# EAGLE design front-panel-module (EAGLE 5.11)
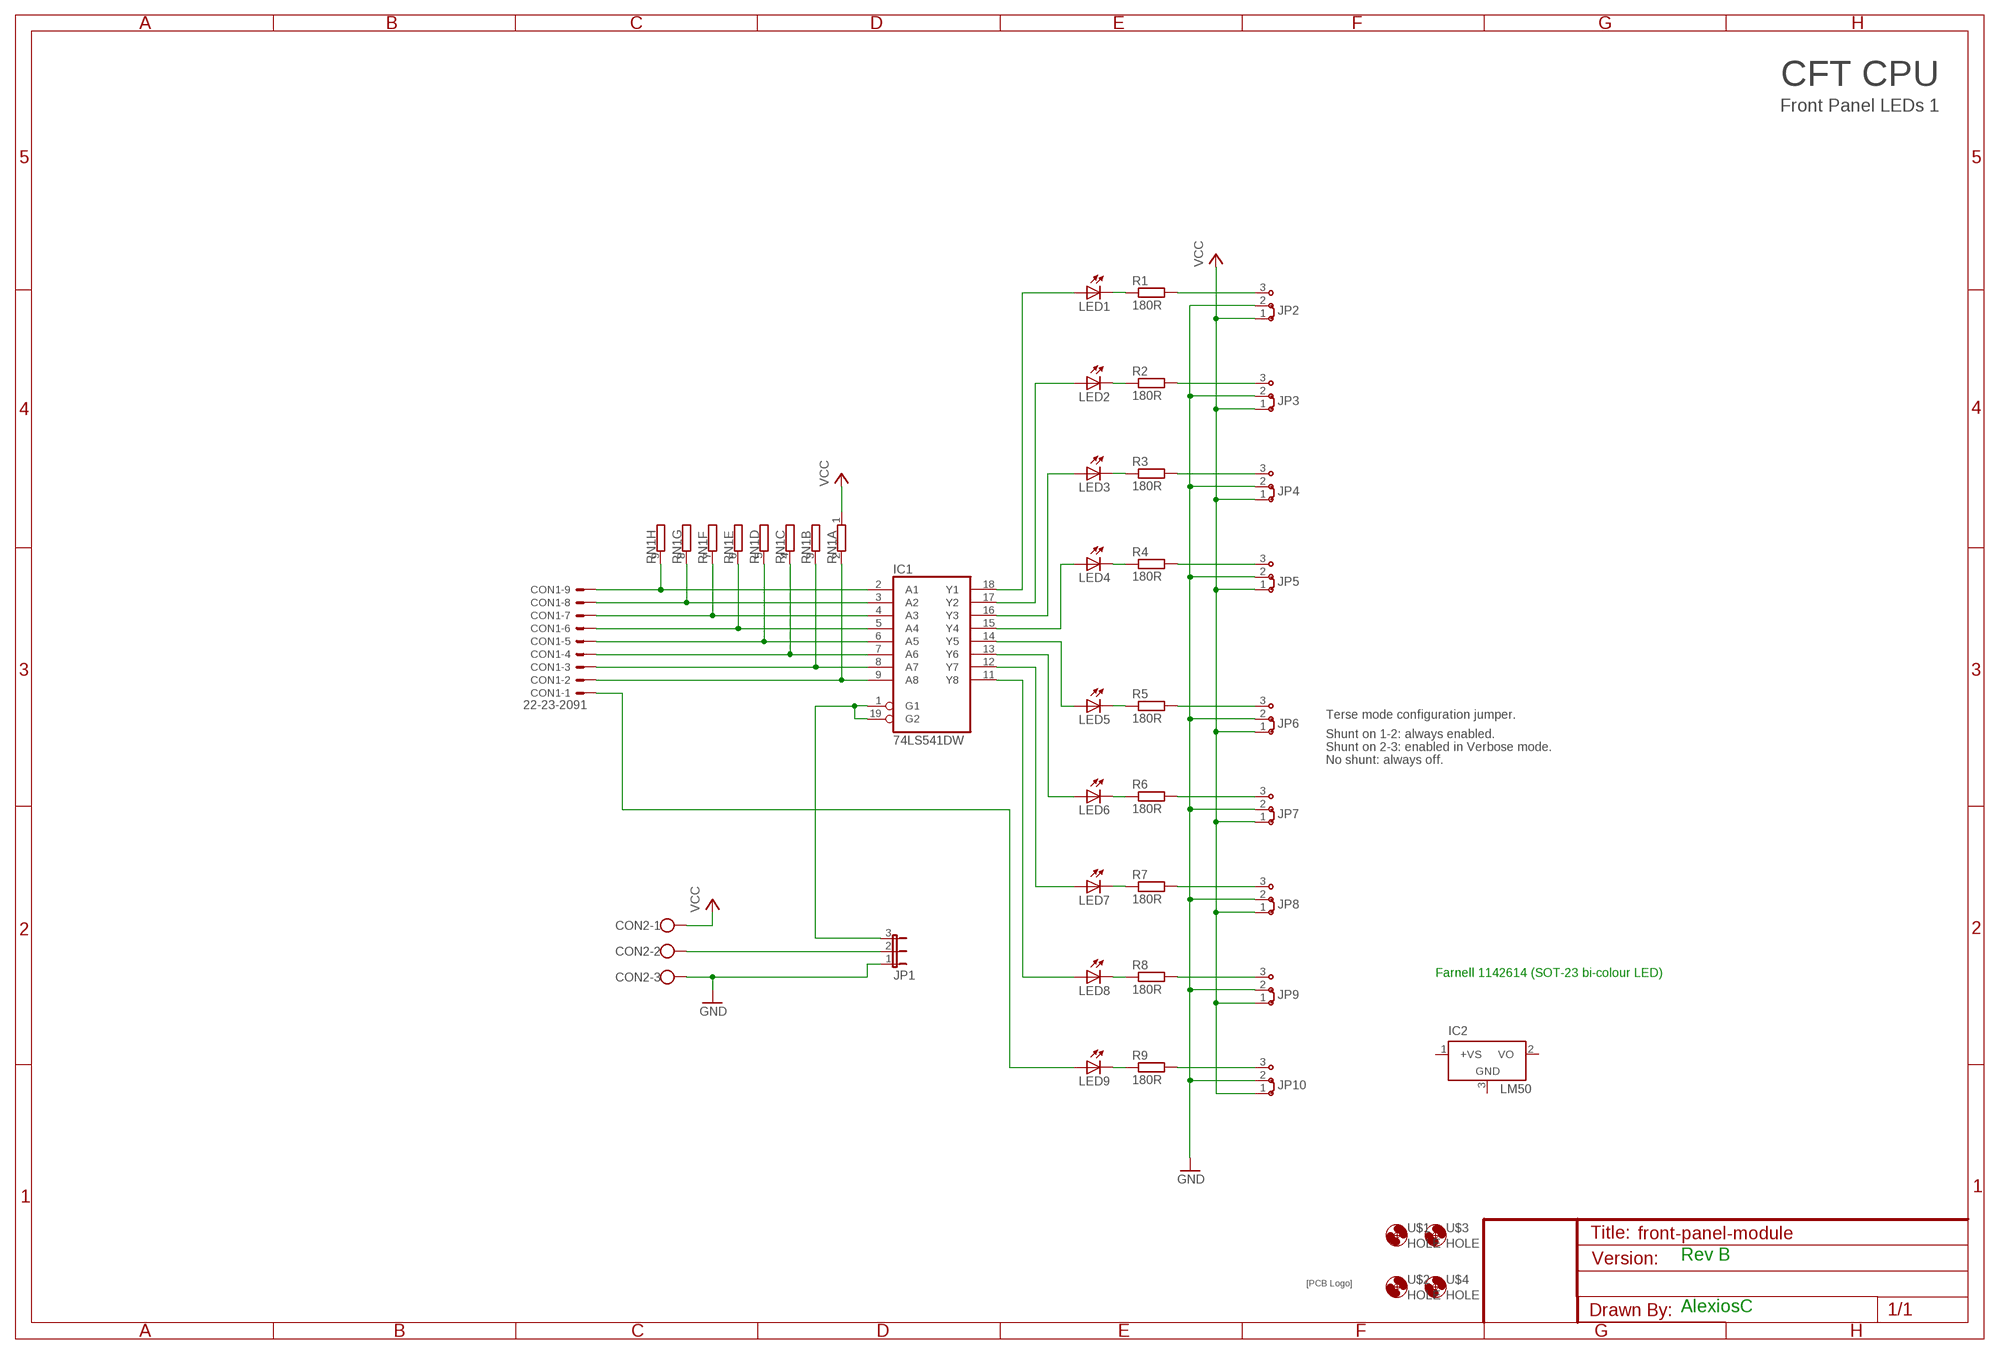
[diagram p0: schematic, sheet 1]

## Parts
CON1  22-23-2091  [22-23-2091]
CON2  W237-103  [W237-103]
IC1  74LS541DW  [SO20W]
IC2  LM50  [SOT23]
JP1  JP2E  [JP2]
JP2  J2  [WJ-100]
JP3  J2  [WJ-100]
JP4  J2  [WJ-100]
JP5  J2  [WJ-100]
JP6  J2  [WJ-100]
JP7  J2  [WJ-100]
JP8  J2  [WJ-100]
JP9  J2  [WJ-100]
JP10  J2  [WJ-100]
LED1  LED-5MM-AMBER  LEDP-LCC-2  [P-LCC-2]
LED2  LED-5MM-AMBER  LEDP-LCC-2  [P-LCC-2]
LED3  LED-5MM-AMBER  LEDP-LCC-2  [P-LCC-2]
LED4  LED-5MM-AMBER  LEDP-LCC-2  [P-LCC-2]
LED5  LED-5MM-AMBER  LEDP-LCC-2  [P-LCC-2]
LED6  LED-5MM-AMBER  LEDP-LCC-2  [P-LCC-2]
LED7  LED-5MM-AMBER  LEDP-LCC-2  [P-LCC-2]
LED8  LED-5MM-AMBER  LEDP-LCC-2  [P-LCC-2]
LED9  LED-5MM-AMBER  LEDP-LCC-2  [P-LCC-2]
R1  180R  R-EU_M0805  [M0805]
R2  180R  R-EU_M0805  [M0805]
R3  180R  R-EU_M0805  [M0805]
R4  180R  R-EU_M0805  [M0805]
R5  180R  R-EU_M0805  [M0805]
R6  180R  R-EU_M0805  [M0805]
R7  180R  R-EU_M0805  [M0805]
R8  180R  R-EU_M0805  [M0805]
R9  180R  R-EU_M0805  [M0805]
RN1  GE08R  [SIL9]
U$1  HOLE  [STANDOFF_28_60]
U$2  HOLE  [STANDOFF_28_60]
U$3  HOLE  [STANDOFF_28_60]
U$4  HOLE  [STANDOFF_28_60]
U$6  SIGNATURESILK  [SIGNATURE]

## Nets
BANK0: CON1.9 IC1.2(A1) RN1.9
BANK1: CON1.8 IC1.3(A2) RN1.8
BANK2: CON1.7 IC1.4(A3) RN1.7
BANK3: CON1.6 IC1.5(A4) RN1.6
BANK4: CON1.5 IC1.6(A5) RN1.5
BANK5: CON1.4 IC1.7(A6) RN1.4
BANK6: CON1.3 IC1.8(A7) RN1.3
BANK7: CON1.2 IC1.9(A8) RN1.2
BANKING: CON1.1 LED9.A
GND: CON2.3 JP1.1 JP2.2 JP3.2 JP4.2 JP5.2 JP6.2 JP7.2 JP8.2 JP9.2 JP10.2
N$1: CON2.2 JP1.2
N$2: IC1.1(G1) IC1.19(G2) JP1.3
N$3: LED1.C R1.1
N$4: JP2.3 R1.2
N$5: JP3.3 R2.2
N$6: JP4.3 R3.2
N$7: JP5.3 R4.2
N$8: JP6.3 R5.2
N$9: JP7.3 R6.2
N$10: JP8.3 R7.2
N$11: JP9.3 R8.2
N$12: LED9.C R9.1
N$13: JP10.3 R9.2
N$84: IC1.15(Y4) LED4.A
N$101: IC1.14(Y5) LED5.A
N$103: IC1.13(Y6) LED6.A
N$104: IC1.12(Y7) LED7.A
N$105: IC1.11(Y8) LED8.A
N$106: IC1.16(Y3) LED3.A
N$107: IC1.17(Y2) LED2.A
N$108: IC1.18(Y1) LED1.A
N$110: LED2.C R2.1
N$111: LED3.C R3.1
N$114: LED4.C R4.1
N$115: LED5.C R5.1
N$116: LED6.C R6.1
N$117: LED7.C R7.1
N$118: LED8.C R8.1
VCC: CON2.1 JP2.1 JP3.1 JP4.1 JP5.1 JP6.1 JP7.1 JP8.1 JP9.1 JP10.1 RN1.1
Unconnected: IC2.1(+VS) IC2.2(VO)

## Notes on the sheet
- CFT CPU
- Front Panel LEDs 1
- Terse mode configuration jumper.
- Shunt on 1-2: always enabled.
- Shunt on 2-3: enabled in Verbose mode.
- No shunt: always off.
- Farnell 1142614 (SOT-23 bi-colour LED)
- Rev B
- AlexiosC

## Power pins joined to a net without a drawn wire
GND: IC1.10(GND) IC2.3(GND)
VCC: IC1.20(VCC)

## Library data of the parts
CON1 = con-molex:22-23-2091: .100" (2.54mm) Center Header - 9 Pin; MF: MOLEX; MPN: 22-23-2091; OC_FARNELL: 1756827; OC_NEWARK: 56H0450
CON2 = con-wago-500:W237-103: WAGO SCREW CLAMP; MPN: 237-103; OC_FARNELL: unknown; OC_NEWARK: 18M7116
IC1 = 74xx-eu:74*541: Octal BUFFER and LINE DRIVER, 3-state
IC2 = linear:LM50: SOT-23 Single-Supply Centigrade Temperature Sensor Vout = (10mV/°C x Temp °C) +5mmmV Source: http://cache.national.com/ds/LM/LM50.pdf
JP1 = jumper:JP2E: JUMPER
JP2-JP10 = alexios:J2: Wire jumper
LED1-LED9 = led:LED: LED OSRAM: - CHIPLED LG R971, LG N971, LY N971, LG Q971, LY Q971, LO R971, LY R971 LH N974, LH R974 LS Q976, LO Q976, LY Q976 LO Q996 - Hyper CHIPLED LW Q18S LB Q993, LB Q99A, LB R99A - SideLED LS A670, LO A670, LY A670, LG A670, LP A670 LB A673, LV A673, LT A673, LW A673 LH A674 LY A675 LS A676, LA A676, LO A676, LY A676, LW A676 LS A679, LY A679, LG A679 - Hyper Micro SIDELED® LS Y876, LA Y876, LO Y876, LY Y876 LT Y87S - SmartLED LW L88C, LW L88S LB L89C, LB L89S, LG L890 LS L89K, LO L89K, LY L89K LS L896, LA L896, LO L896, LY L896 - TOPLED LS T670, LO T670, LY T670, LG T670, LP T670 LSG T670, LSP T670, LSY T670, LOP T670, LYG T670 LG T671, LOG T671, LSG T671 LB T673, LV T673, LT T673, LW T673 LH T674 LS T676, LA T676, LO T676, LY T676, LB T676, LH T676, LSB T676, LW T676 LB T67C, LV T67C, LT T67C, LS T67K, LO T67K, LY T67K, LW E67C LS E67B, LA E67B, LO E67B, LY E67B, LB E67C, LV E67C, LT E67C LW T67C LS T679, LY T679, LG T679 LS T770, LO T770, LY T770, LG T770, LP T770 LB T773, LV T773, LT T773, LW T773 LH T774 LS E675, LA E675, LY E675, LS T675 LS T776, LA T776, LO T776, LY T776, LB T776 LHGB T686 LT T68C, LB T68C - Hyper Mini TOPLED® LB M676 - Mini TOPLED Santana® LG M470 LS M47K, LO M47K, LY M47K Source: http://www.osram.convergy.de LUXEON: - LUMILED® LXK2-PW12-R00, LXK2-PW12-S00, LXK2-PW14-U00, LXK2-PW14-V00 LXK2-PM12-R00, LXK2-PM12-S00, LXK2-PM14-U00 LXK2-PE12-Q00, LXK2-PE12-R00, LXK2-PE12-S00, LXK2-PE14-T00, LXK2-PE14-U00 LXK2-PB12-K00, LXK2-PB12-L00, LXK2-PB12-M00, LXK2-PB14-N00, LXK2-PB14-P00, LXK2-PB14-Q00 LXK2-PR12-L00, LXK2-PR12-M00, LXK2-PR14-Q00, LXK2-PR14-R00 LXK2-PD12-Q00, LXK2-PD12-R00, LXK2-PD12-S00 LXK2-PH12-R00, LXK2-PH12-S00 LXK2-PL12-P00, LXK2-PL12-Q00, LXK2-PL12-R00 Source: www.luxeon.com KINGBRIGHT: KA-3528ASYC Source: www.kingbright.com
R1-R9 = resistor:R-EU_: RESISTOR, European symbol
RN1 = resistor-sil:GE08R: SIL RESISTOR; OC_FARNELL: unknown; OC_NEWARK: unknown
U$1-U$4 = alexios:HOLE: Hole for a standoff or mount. Hole diameter: 3.3mm. External Diameter: 6mm.
U$6 = alexios:SIGNATURE: Soup signature

## Net classes
0 default: width 0.305 mm, clearance 0.254 mm

## Board
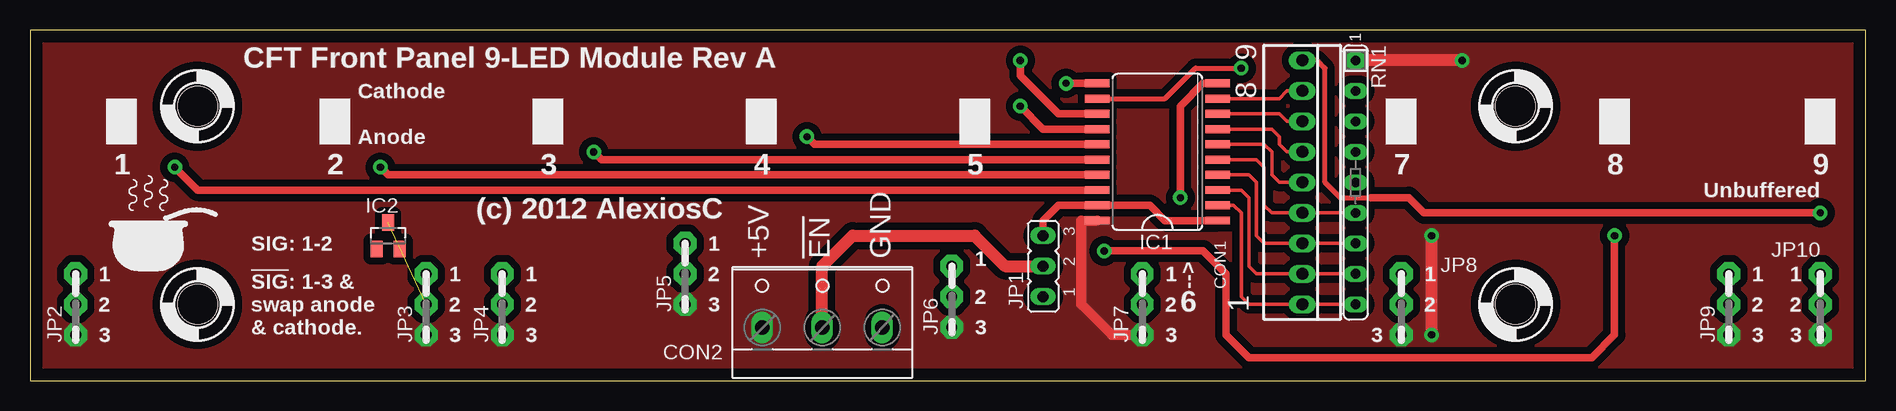
[diagram p1: board, top side]
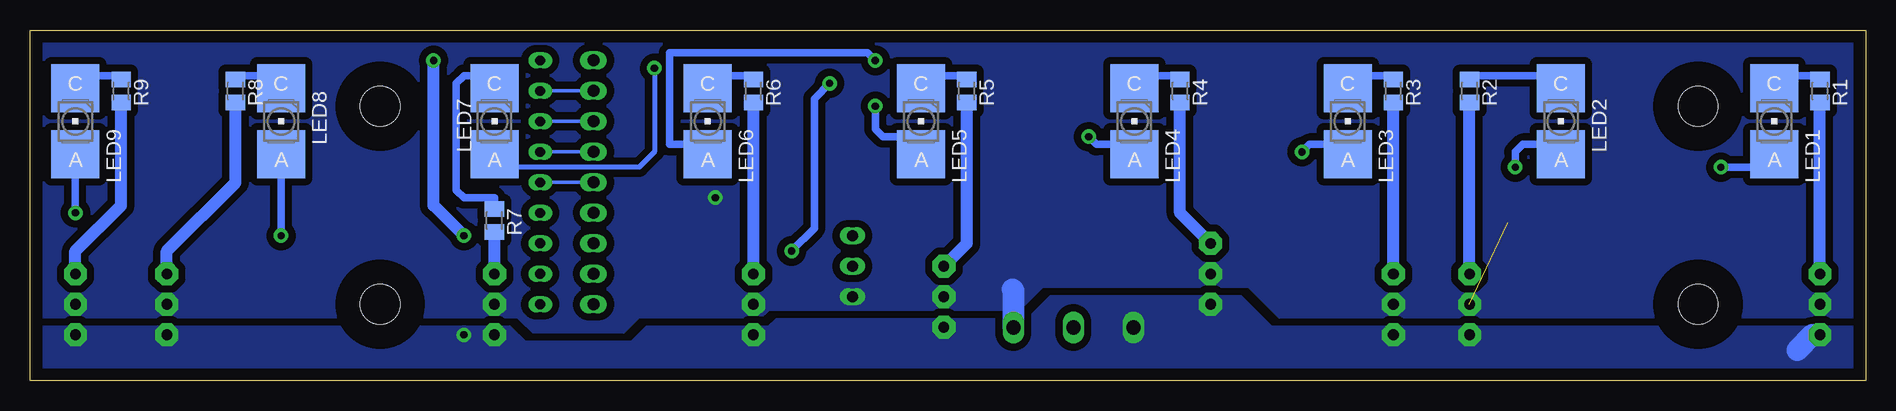
[diagram p2: board, bottom side, seen from below]

Size 153.01 x 29.21 mm. Coordinates in mm from the lower left corner, seen from the top.
Outline: 0,0 153.01,0 153.01,29.21 0,29.21 0,0
Copper layers (1*16): Top 0.035mm / dielectric 1.5mm / Bottom 0.035mm
Design rules "cft-olimex-10mil-small-pads-tented-vias": minimum track width 10mil, minimum drill 24mil, track to track 10mil, track to pad 10mil, pad to pad 10mil, via to via 10mil, smd to smd 10mil, copper to edge 40mil, drill to drill 10mil, minimum pad ring 10mil, minimum via ring 12mil, stop-mask expansion 4mil, vias tented up to drill 30mil, thermal gap 10mil

### Footprints (pad centres in the part's own frame; a part is rotated, then mirrored left to right if it is on the bottom)
22-23-2091 = drill 1 long: 1 -10.16,0; 2 -7.62,0; 3 -5.08,0; 4 -2.54,0; 5 0,0; 6 2.54,0; 7 5.08,0; 8 7.62,0; 9 10.16,0
W237-103 = drill 1.194 long: 1 -5,-1.29; 2 0,-1.29; 3 5,-1.29
SO20W = smd 0.66 x 2.032: 1 -5.715,-5.029; 2 -4.445,-5.029; 3 -3.175,-5.029; 4 -1.905,-5.029; 5 -0.635,-5.029; 6 0.635,-5.029; 7 1.905,-5.029; 8 3.175,-5.029; 9 4.445,-5.029; 10 5.715,-5.029; 11 5.715,5.029; 12 4.445,5.029; 13 3.175,5.029; 14 1.905,5.029; 15 0.635,5.029; 16 -0.635,5.029; 17 -1.905,5.029; 18 -3.175,5.029; 19 -4.445,5.029; 20 -5.715,5.029
SOT23 = smd 1 x 1.4: 1 -0.95,-1.1; 2 0.95,-1.1; 3 0,1.1
JP2 = drill 0.914 long: 1 -2.54,0; 2 0,0; 3 2.54,0
WJ-100 = drill 0.889 pad 1.905 octagon: 1 -2.54,0; 2 0,0; 3 2.54,0
P-LCC-2 = smd 4 x 4: A 0,2.75; C 0,-2.75
M0805 = smd 1.3 x 1.6: 1 -0.95,0; 2 0.95,0
SIL9 = drill 0.813 long: 1 -10.16,0; 2 -7.62,0; 3 -5.08,0; 4 -2.54,0; 5 0,0; 6 2.54,0; 7 5.08,0; 8 7.62,0; 9 10.16,0
STANDOFF_28_60 = hole 3.302: 0,0

### Placement (x,y rotation side)
CON1  106.05,16.51 270 top
CON2  66.04,5.71 0 top
IC1  93.98,19.05 90 top
IC2  29.84,12.06 0 top
JP1  84.45,9.53 90 top
JP2  3.81,6.35 90 top
JP3  33.02,6.35 90 top
JP4  39.37,6.35 90 top
JP5  54.61,8.89 90 top
JP6  76.83,6.99 90 top
JP7  92.71,6.35 90 top
JP8  114.3,6.35 90 top
JP9  141.6,6.35 90 top
JP10  149.22,6.35 90 top
LED1  7.62,21.59 180 bottom
LED2  25.4,21.59 180 bottom
LED3  43.18,21.59 180 bottom
LED4  60.96,21.59 180 bottom
LED5  78.74,21.59 180 bottom
LED6  96.52,21.59 180 bottom
LED7  114.3,21.59 180 bottom
LED8  132.08,21.59 180 bottom
LED9  149.22,21.59 180 bottom
R1  3.81,24.13 270 bottom
R2  33.02,24.13 270 bottom
R3  39.37,24.13 270 bottom
R4  57.15,24.13 270 bottom
R5  74.93,24.13 270 bottom
R6  92.71,24.13 270 bottom
R7  114.3,13.34 270 bottom
R8  135.89,24.13 270 bottom
R9  145.41,24.13 270 bottom
RN1  110.49,16.51 270 top
U$1  13.97,6.35 0 top
U$2  123.83,22.86 0 top
U$3  13.97,22.86 0 top
U$4  123.83,6.35 0 top
U$6  6.99,8.89 0 top

### Tracks (layer width: path | path; a pad name or v marks a point on that pad's centre or on a via)
BANK0
  Top 0.305: IC1.2 100.33,14.61 100.97,13.97 100.97,6.99 101.6,6.35 CON1.9 RN1.9
BANK1
  Top 0.305: IC1.3 100.97,15.88 101.6,15.24 101.6,9.53 102.23,8.89 CON1.8 RN1.8
BANK2
  Top 0.305: IC1.4 101.6,17.14 102.23,16.51 102.23,12.06 102.87,11.43 CON1.7 RN1.7
BANK3
  Top 0.305: IC1.5 102.23,18.41 102.87,17.78 102.87,14.61 103.5,13.97 CON1.6 RN1.6
BANK4
  Top 0.305: IC1.6 102.87,19.68 103.5,19.05 103.5,17.14 104.14,16.51 CON1.5
  Bottom 0.305: CON1.5 RN1.5
BANK5
  Top 0.305: IC1.7 103.5,20.95 104.14,20.32 104.14,19.68 104.78,19.05 CON1.4
  Bottom 0.305: CON1.4 RN1.4
BANK6
  Top 0.305: IC1.8 104.14,22.23 104.78,21.59 CON1.3
  Bottom 0.305: CON1.3 RN1.3
BANK7
  Top 0.305: IC1.9 104.14,23.5 104.78,24.13 CON1.2
  Bottom 0.305: CON1.2 RN1.2
BANKING  (via drill 0.6)
  Top 0.406: 111.76,15.24 109.22,15.24 107.95,16.51 107.95,26.04 107.31,26.67 CON1.1
  Top 0.61: 111.76,15.24 114.94,15.24 116.2,13.97 v149.22,13.97
  Bottom 0.61: v149.22,13.97 LED9.A
GND  (via drill 0.6)  (1 unrouted)
  Top 0.61: IC1.10 97.79,24.77 95.89,22.86 v95.89,15.24
  Bottom 1.778: CON2.3 71.04,7.54 71.12,7.62
  pour Bottom (isolate 0.61, rank 6, no thermals): 0,2.54 0,28.57 153.03,28.57 153.03,2.54
N$1
  Top 1.016: CON2.2 66.04,9.53 68.58,12.06 78.74,12.06 81.28,9.53 JP1.2
N$2
  Top 0.61: JP1.3 84.45,13.34 85.72,14.61 IC1.19 93.34,14.61 94.61,13.34 IC1.1
N$3
  Bottom 0.61: R1.1 4.13,25.4 7.62,25.4 LED1.C 7.62,24.13
N$4
  Bottom 1.016: JP2.3 R1.2
N$5
  Bottom 1.016: JP3.3 R2.2
N$6
  Bottom 1.016: JP4.3 R3.2
N$7
  Bottom 1.016: JP5.3 57.15,13.97 R4.2
N$8
  Bottom 1.016: JP6.3 74.93,11.43 R5.2
N$9
  Bottom 1.016: JP7.3 R6.2
N$10
  Bottom 1.016: JP8.3 R7.2
N$11
  Bottom 1.016: JP9.3 141.6,10.79 135.89,16.51 R8.2
N$12
  Bottom 0.61: R9.1 145.74,25.4 149.22,25.4 LED9.C
N$13
  Bottom 1.016: JP10.3 149.22,10.79 145.41,14.61 R9.2
N$84  (via drill 0.6)
  Top 0.61: IC1.15 65.41,19.68 v64.77,20.32
  Bottom 0.61: v64.77,20.32 64.14,19.68 60.96,19.68 LED4.A
N$101  (via drill 0.6)
  Top 0.61: v82.55,22.86 84.45,20.95 IC1.14
  Bottom 0.61: LED5.A 78.74,19.68 79.38,20.32 81.92,20.32 82.55,20.95 v82.55,22.86
N$103  (via drill 0.6)
  Top 0.61: IC1.13 85.72,22.23 82.55,25.4 v82.55,26.67
  Bottom 0.61: v82.55,26.67 83.19,27.3 99.69,27.3 99.69,19.68 96.52,19.68 LED6.A
N$104  (via drill 0.6)
  Top 0.406: IC1.12 94.61,23.5 97.16,26.04 v100.97,26.04
  Bottom 0.305: 113.67,17.78 114.3,18.41
  Bottom 0.406: v100.97,26.04 100.97,19.05 102.23,17.78 113.67,17.78
  Bottom 1.016: 114.3,18.41 LED7.A
N$105  (via drill 0.6)
  Top 0.61: v86.36,24.77 IC1.11 | v89.53,10.79 97.79,10.79 99.69,8.89 99.69,3.81 101.6,1.91 130.18,1.91 132.08,3.81 v132.08,12.06
  Bottom 0.305: 132.08,17.78 LED8.A
  Bottom 0.61: v86.36,24.77 87.63,23.5 87.63,12.7 v89.53,10.79 | v132.08,12.06 132.08,17.78
N$106  (via drill 0.6)
  Top 0.61: v46.99,19.05 47.62,18.41 IC1.16
  Bottom 0.61: v46.99,19.05 46.35,19.68 43.18,19.68 LED3.A
N$107  (via drill 0.6)
  Top 0.61: v29.21,17.78 29.84,17.14 IC1.17
  Bottom 0.61: v29.21,17.78 29.21,19.05 28.57,19.68 25.4,19.68 LED2.A
N$108  (via drill 0.6)
  Top 0.61: IC1.18 13.97,15.88 v12.06,17.78
  Bottom 0.61: v12.06,17.78 8.68,17.78 LED1.A
N$110
  Bottom 0.61: 25.4,24.13 LED2.C 25.4,25.4 33.02,25.4 R2.1
N$111
  Bottom 0.61: R3.1 39.69,25.4 43.18,25.4 LED3.C
N$114
  Bottom 0.61: R4.1 57.47,25.4 60.96,25.4 LED4.C
N$115
  Bottom 0.61: R5.1 75.25,25.4 78.74,25.4 LED5.C
N$116
  Bottom 0.61: R6.1 93.03,25.4 96.52,25.4 LED6.C
N$117
  Bottom 0.61: LED7.C 114.3,25.4 116.84,25.4 117.47,24.77 117.47,15.88 116.84,15.24 114.3,15.24 R7.1
N$118
  Bottom 0.61: 132.08,25.4 131.13,25.4 | LED8.C 132.08,25.4 | 132.08,25.4 135.89,25.4 R8.1
VCC  (via drill 0.6)
  Top 0.813: IC1.20 87.63,13.34 87.63,6.35 90.17,3.81 JP7.1
  Top 1.016: v119.38,26.67 RN1.1 | v116.84,3.81 v116.84,12.06
  Bottom 1.016: CON2.1 60.98,4.42 | v119.38,26.67 119.38,14.61 v116.84,12.06
  Bottom 1.778: JP2.1 4.45,3.81 5.71,2.54
  pour Bottom (isolate 0.61, rank 5, no thermals): 0,0 0,4.45 49.53,4.45 52.07,6.99 67.94,6.99 69.85,5.08 90.81,5.08 91.44,4.45 101.6,4.45 102.87,3.17 111.76,3.17 113.03,4.45 153.03,4.45 153.03,0
  pour Top (isolate 0.61, no thermals): 0,29.21 0,0 153.03,0 153.03,29.21

### Text on the board
tNames: 9 | CFT Front Panel 9-LED Module Rev A | Cathode | 8 | Anode | 1 | 2 | 3 | 4 | 5 | 7 | 8 | 9 | Unbuffered | (c) 2012 AlexiosC | SIG: 1-2 | 1 | +5V | !EN! | GND | 1 | 1 | !SIG!: 1-3 & | 1 | 1 | 2 | 1 | --> | 1 | 1 | 1 | 2 | swap anode | 2 | 2 | 3 | 2 | 2 | 6 | 1 | 2 | 2 | 2 | & cathode. | 3 | 3 | 3 | 3 | 3 | 3 | 3 | 3